# Altium schematic sheet PADS_Schemat.SchDoc
size A3; SheetNumber: 1; SheetTotal: 1
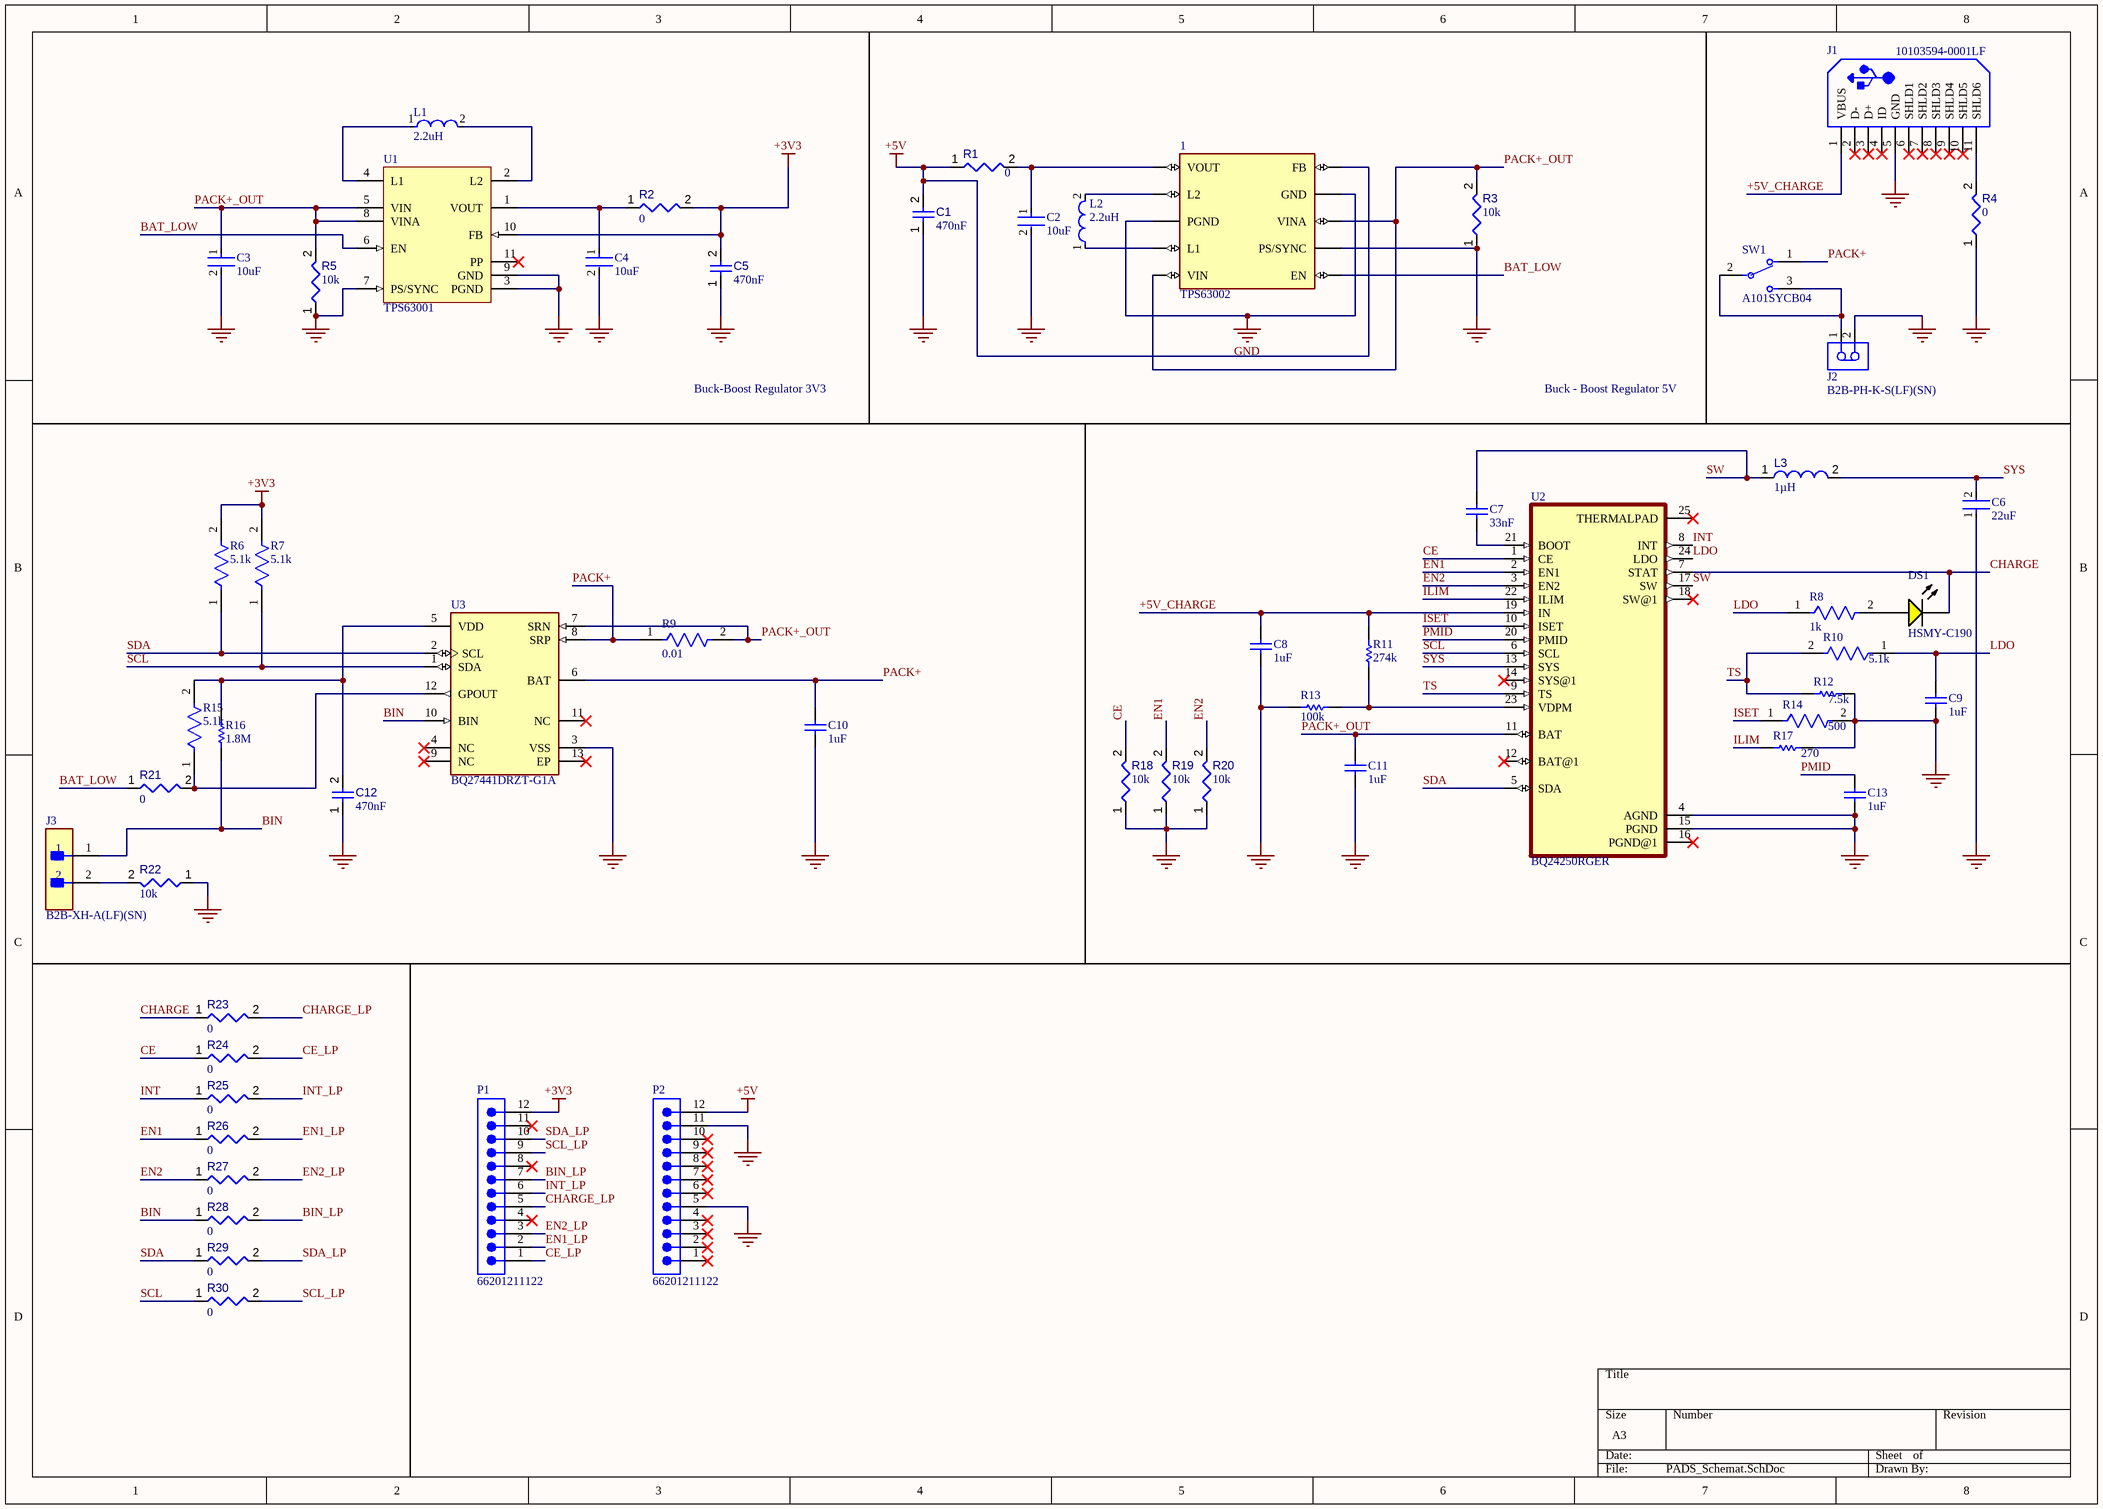
[diagram p0: PADS_Schemat.SchDoc]

## Parts
1  TPS63002  [10SON]
C1  value 470nF  [CAPC0603(1608)100_L]  (hidden comment: Capacitor 470nF +/-20% 25V 0603)
C2  10uF  [FP-GRM188-0_1-e0_2_0_55-IPC_A]
C3  10uF  [FP-GRM188-0_1-e0_2_0_55-IPC_A]
C4  10uF  [FP-GRM188-0_1-e0_2_0_55-IPC_A]
C5  value 470nF  [CAPC0603(1608)100_L]  (hidden comment: Capacitor 470nF +/-20% 25V 0603)
C6  22uF  [FP-GRM21B-0_15-MFG]
C7  33nF  [CAPC2013X95X45NL10T25]
C8  1uF  [CAPC2013X135X45LL10T25]
C9  1uF  [CAPC2013X135X45LL10T25]
C10  1uF  [CAPC2013X135X45LL10T25]
C11  1uF  [CAPC2013X135X45LL10T25]
C12  value 470nF  [CAPC0603(1608)100_L]  (hidden comment: Capacitor 470nF +/-20% 25V 0603)
C13  1uF  [CAPC2013X135X45LL10T25]
DS1  HSMY-C190  [AVAG-HSMX-C190_V]
J1  10103594-0001LF  [FCI-10103594-0001LF_V]
J2  B2B-PH-K-S(LF)(SN)  [JST-B2B-PH-K-S_V]
J3  B2B-XH-A(LF)(SN)  [FP-B2B-XH-A_LF_SN-MFG]
L1  2.2uH  [FP-LQM21PH_G0-IPC_C]
L2  2.2uH  [FP-LQM21PH_G0-IPC_C]
L3  value 1µH  [INDC2520X120X60NL20T20]  (hidden comment: LQM2HPN1R0MJ0L)
P1  66201211122  [66201211122]
P2  66201211122  [66201211122]
R1  value 0  [RESC0603(1608)_L]  (hidden comment: 0R3J)
R2  value 0  [RESC0603(1608)_L]  (hidden comment: 0R3J)
R3  value 10k  [RESC0402(1005)_L]  (hidden comment: 10KR2F)
R4  value 0  [RESC0603(1608)_L]  (hidden comment: 0R3J)
R5  value 10k  [RESC0402(1005)_L]  (hidden comment: 10KR2F)
R6  5.1k  [FP-CRCW0603-e3-IPC_C]
R7  5.1k  [FP-CRCW0603-e3-IPC_C]
R8  1k  [FP-ERA3A-IPC_C]
R9  0.01  [FP-ERJ8CW-MFG]
R10  5.1k  [FP-CRCW0603-e3-IPC_C]
R11  274k  [RESC1608X55X30NL15T15]
R12  7.5k  [RESC1609X55X30NL10T20]
R13  100k  [RESC2013X70X40NL20T20]
R14  500  [FP-MCT0603-MFG]
R15  5.1k  [FP-CRCW0603-e3-IPC_C]
R16  1.8M  [RESC1608X55X30ML15T15]
R17  270  [RESC1608X55X30LL15T15]
R18  value 10k  [RESC0402(1005)_L]  (hidden comment: 10KR2F)
R19  value 10k  [RESC0402(1005)_L]  (hidden comment: 10KR2F)
R20  value 10k  [RESC0402(1005)_L]  (hidden comment: 10KR2F)
R21  value 0  [RESC0603(1608)_L]  (hidden comment: 0R3J)
R22  value 10k  [RESC0402(1005)_L]  (hidden comment: 10KR2F)
R23  value 0  [RESC0603(1608)_L]  (hidden comment: 0R3J)
R24  value 0  [RESC0603(1608)_L]  (hidden comment: 0R3J)
R25  value 0  [RESC0603(1608)_L]  (hidden comment: 0R3J)
R26  value 0  [RESC0603(1608)_L]  (hidden comment: 0R3J)
R27  value 0  [RESC0603(1608)_L]  (hidden comment: 0R3J)
R28  value 0  [RESC0603(1608)_L]  (hidden comment: 0R3J)
R29  value 0  [RESC0603(1608)_L]  (hidden comment: 0R3J)
R30  value 0  [RESC0603(1608)_L]  (hidden comment: 0R3J)
SW1  A101SYCB04  [FP-A101SYCB04-MFG]
U1  TPS63001  [DRC0010J_V]
U2  BQ24250RGER  [QFN50P400X400X100-25N]
U3  BQ27441DRZT-G1A  [FP-DRZ0012A-MFG]

## Nets
+3V3: C5.2 P1.12 R2.2 R6.2 R7.2 U1.10(FB)
+5V: 1.P$10(FB) C1.2 P2.12 R1.1
GND: 1.P$3(PGND) 1.P$7(PS/SYNC) 1.P$9(GND) C1.1 C2.2 C3.2 C4.2 C5.1 C6.1 C8.1 C9.1 C10.1 C11.1 C12.1 C13.1 J1.5(GND) J2.2 P2.5 P2.11 R3.1 R4.1 R5.1 R12.2 R13.1 R14.2 R17.2 R18.1 R19.1 R20.1 R22.1 U1.3(PGND) U1.7(PS/SYNC) U1.9(GND) U2.4(AGND) U2.15(PGND) U3.3(VSS)
+5V_CHARGE: C8.2 J1.1(VBUS) R11.2 U2.19(IN)
BAT_LOW: 1.P$6(EN) R21.1 U1.6(EN)
BIN: J3.1 R16.1 R28.1 U3.10(BIN)
BIN_LP: P1.7 R28.2
CE: R18.2 R24.1 U2.1(CE)
CE_LP: P1.1 R24.2
CHARGE: DS1.2(K) R23.1 U2.7(STAT)
CHARGE_LP: P1.5 R23.2
EN1: R19.2 R26.1 U2.2(EN1)
EN1_LP: P1.2 R26.2
EN2: R20.2 R27.1 U2.3(EN2)
EN2_LP: P1.3 R27.2
ILIM: R17.1 U2.22(ILIM)
INT: R25.1 U2.8(INT)
INT_LP: P1.6 R25.2
ISET: R14.1 U2.10(ISET)
LDO: C9.2 R8.1 R10.1 U2.24(LDO)
PACK+: C10.2 R9.1 SW1.1 U3.6(BAT) U3.8(SRP)
PACK+_OUT: 1.P$5(VIN) 1.P$8(VINA) C3.1 C11.2 R3.2 R5.2 R9.2 U1.5(VIN) U1.8(VINA) U2.11(BAT) U3.7(SRN)
PMID: C13.2 U2.20(PMID)
SCL: R7.1 R30.1 U2.6(SCL) U3.1(SDA)
SCL_LP: P1.9 R30.2
SDA: R6.1 R29.1 U2.5(SDA) U3.2(SCL)
SDA_LP: P1.10 R29.2
SW: C7.2 L3.1 U2.17(SW)
SYS: C6.2 L3.2 U2.13(SYS)
TS: R10.2 R12.1 U2.9(TS)
Net1_P$1: 1.P$1(VOUT) C2.1 R1.2
Net1_P$2: 1.P$2(L2) L2.2
Net1_P$4: 1.P$4(L1) L2.1
NetC4_1: C4.1 R2.1 U1.1(VOUT)
NetC7_1: C7.1 U2.21(BOOT)
NetC12_2: C12.2 R15.2 R16.2 U3.5(VDD)
NetDS1_1: DS1.1(A) R8.2
NetJ1_11: J1.11(SHLD6) R4.2
NetJ2_1: J2.1 SW1.2 SW1.3
NetJ3_2: J3.2 R22.2
NetL1_1: L1.1 U1.4(L1)
NetL1_2: L1.2 U1.2(L2)
NetR11_1: R11.1 R13.2 U2.23(VDPM)
NetR15_1: R15.1 R21.2 U3.12(GPOUT)

Not connected (* = marked no-connect by the designer): J1 2(D-)* 3(D+)* 4(ID)* 6(SHLD1)* 7(SHLD2)* 8(SHLD3)* 9(SHLD4)* 10(SHLD5)*; P1 4* 8* 11*; P2 1* 2* 3* 4* 6* 7* 8* 9* 10*; U1 11(PP)*; U2 12(BAT@1)* 14(SYS@1)* 16(PGND@1)* 18(SW@1)* 25(THERMALPAD)*; U3 4(NC)* 9(NC)* 11(NC)* 13(EP)*

## Notes on the sheet
- Buck-Boost Regulator 3V3
- Buck - Boost Regulator 5V

## Library data of the parts
1 = CMP-023-000000-1: Buck-Boost Switching Regulator IC Positive Fixed 5V 1 Output 1.6A _Switch_ 10-VFDFN Exposed Pad; MF: Texas Instruments; MP: TPS63002; Value: *; SnapEDA_Link: https://www.snapeda.com/parts/TPS63002/Texas%20Instruments/view-part/509729/?ref=snap; Pin Count: 10; Package: QFN-10 Texas Instruments; Component Type: Standard; Availability: Unavailable; Design Item ID: TPS63002; Price: None; Source: SnapEDAsch.SchLib
C1 C5 C12 = CMP-001-00077-3: Chip Capacitor, 470nF +/-20%, 25V, 0603, Thickness 1 mm; Tolerance: 10%; Max Operating Temperature: 85°C; Voltage Rating: 25V; Pins: 2; Case/Package: 0603; Mounting Technology: SMT; Min Operating Temperature: -55°C
C2-C4 = CMP-2006-02792-2: Chip Multilayer Ceramic Capacitors for General Purpose, 0603, 10uF, X5R, 15%, 20%, 6.3V; Packaging: Tape and Reel; Voltage Rating (DC): 6.3V; Width: 0.031inch; Termination: SMD/SMT; Dielectric: X5R; Package Quantity: 4000; Voltage Rating: 6.3V; Capacitance: 10uF; Case/Package: 0603; Min Operating Temperature: -55°C; Voltage: 6.3V; Length: 1.6mm; Thickness: 0.035inch; Lead Free: Lead Free; Depth: 0.8mm; Case Code (Imperial): 0603; Max Operating Temperature: 85°C; Material: Ceramic; Height: 0.8mm; Tolerance: 20%; Mount: Surface Mount; REACH SVHC: No SVHC; Radiation Hardening: No; Case Code (Metric): 1608
C6 = CMP-2007-03385-2: Chip Multilayer Ceramic Capacitors for General Purpose, 0805, 22uF, X5R, 15%, 20%, 6.3V; Material: Ceramic; Max Operating Temperature: 85°C; Voltage: 6.3V; Min Operating Temperature: -55°C; Case/Package: 0805; Thickness: 0.053inch; Dielectric: X5R; Packaging: Tape and Reel; Depth: 1.25mm; Termination: SMD/SMT; Voltage Rating (DC): 6.3V; Radiation Hardening: No; Tolerance: 20%; Mount: Surface Mount; Lead Free: Lead Free; Package Quantity: 1; REACH SVHC: No SVHC; Voltage Rating: 6.3V; Capacitance: 22uF; Length: 2mm; Case Code (Imperial): 0805; Case Code (Metric): 2012; Width: 0.049inch; Height: 1.25mm
C7 = CMP-1036-04169-2: Manufacturer: Murata; Part Number: GRM219R71H333KA01D
C8-C11 C13 = CMP-2007-03460-1: Manufacturer: Murata; Part Number: GRM21BR71C105KA01K
DS1 = CMP-1744-00003-1: LED Uni-Color Yellow, 65 mW, 20 mA, -40 to 85 degC, 2-Pin SMD, RoHS, Tape and Reel; Tolerance: 1%; Voltage Rating: 50 V; Power Rating: 100 mW; Case\Package: 0603; Resistance: 390 Ohm; Min Operating Temperature: -55 degC; Length: 1.6 mm; ComponentLink3Description: Package Specification; Mount: Surface Mount; PackageReference: HSMX-C190; ComponentLink2Description: Datasheet; DatasheetVersion: Mar-12; Case Code (Metric): 1608; Pins: 2; Package Quantity: 5000; ComponentLink2URL: http://docs.avagotech.com/docs/AV02-0551EN; ComponentLink1Description: Manufacturer URL; RoHSCompliant: true; Packaging: Tape and Reel; PackageDescription: 2-Pin Surface Mount Device, Body 1.6 x 0.8 mm, Height 0.9 mm; REACH SVHC: No SVHC; ComponentLink3URL: http://www.fairchildsemi.com/dwg/MA/MA03D.pdf; Voltage Rating (DC): 50 V; Width: 0.8 mm; ComponentLink1URL: http://www.avagotech.com/; Max Operating Temperature: 155 degC; Case Code (Imperial): 0603; Height: 0.45 mm
J1 = CMP-002-00038-2: Micro USB 2.0 B Receptacle, 5 Position, Height 3.24 mm, -55 to 85 degC, RoHS, Tape and Reel; Manufacturer: FCI Electronics; Gender: Female; Current Rating: 1.8A; Voltage Rating: 100V; Min Operating Temperature: -55°C; Package Reference: FCI-10103594-0001LF; Max Operating Temperature: 85°C; Lead Pitch: 0.65mm; Case/Package: FCI-10103594-0001LF; Package Quantity: 1500; Connector Type: USB; Mounting Technology: SM; Datasheet Version: Rev. A, 06/2010; Contact Material: Copper; Package Description: 5-Pin Surface Mount Device, Body 8.04 x 5.62 mm; Contact Plating: Gold; Packaging: TapeandReel; Datasheet URL: http://portal.fciconnect.com/Comergent//fci/drawing/10103594.pdf; Pins: 5; RoHS Compliant: True; Manufacturer URL: http://portal.fciconnect.com/
J2 = CMP-2000-05162-1: Male Header, Pitch 2 mm, 1 x 2 Position, Height 6 mm, Tail Length 3.4 mm, -25 to 85 degC, RoHS, Bulk; Manufacturer: JST; Pitch: 2mm; Style/Orientation: StraightHeader/Plug; No of Positions: 2; Datasheet Version: Nov-08; Datasheet URL: http://datasheet.octopart.com/B2B-PH-K-S%28LF%29%28SN%29-JST-datasheet-8324864.pdf; Manufacturer URL: http://www.jst.com/home2.html; Type: ShroudedHeader; Termination: Crimp
J3 = CMP-2000-05888-3: CONN HEADER VERT 2POS 2.5MM; Current Rating: 3A; Voltage Rating: 250V; Number of Contacts: 2; Contact Resistance: 20mR; Wire/Cable Gauge: 22AWG; Insulation Resistance: 1GR; Connector Type: Male Pin; Packaging: Bulk; Contact Material: Brass; Lead Free: Lead Free; Orientation: Straight; Contact Plating: Tin; Max Current Rating: 3A; Termination: Solder; Fastening Type: Detent; Depth: 5.75mm; Housing Material: Polyamide; REACH SVHC: No SVHC; Series: XH; Voltage Rating (AC): 250V; Number of Positions: 2; Color: Natural; Contact Type: Male Pin; Max Voltage Rating (DC): 250V; Pitch: 2.5mm; Lead Pitch: 2.5mm; Mount: Through Hole; Max Operating Temperature: 85°C; Length: 7.4mm; Max Voltage Rating (AC): 250V; Min Operating Temperature: -25°C; Number of Rows: 1; Housing Color: White
L1 L2 = CMP-06042-016317-1: Multilayer Type Inductor for Power Lines, 0805 (2012), 2.2μH, 30%, 0.288Ω, 0.8A; Test Frequency: 1MHz; Shielding: Shielded; Current Rating: 800mA; Self Resonant Frequency: 40MHz; Core Material: Ferrite; DC Resistance (DCR): 288mR; RoHS Compliant: Yes; REACH SVHC: No SVHC; Inductance Tolerance: 30%; Package Quantity: 4000; Military Standard: Not; Max Operating Temperature: 125°C; Radiation Hardening: No; Series: LQM; Height - Seated (Max): 0.039inch; Tolerance: 30%; Height: 0.9mm; Lead Free: Lead Free; Case Code (Metric): 2012; Packaging: Tape and Reel; Termination: SMD/SMT; Case Code (Imperial): 0805; Min Operating Temperature: -55°C; Depth: 1.4mm; Mount: Surface Mount; Length: 2mm; Inductance: 2.2uH; DC Current: 800mA; Case/Package: 0805; Max DC Current: 800mA; Width: 0.049inch
L3 = CMP-006-00008-6: Chip Inductor, 1 uH, +/- 20%, 1 MHz, -55 to 125 degC, 1008 (2520 Metric), RoHS, Tape and Reel; Manufacturer: Murata; Self Resonant Frequency: 70MHz; Current Rating: 1.5A; Shielding: Shielded; Core Material: Ferrite; Resistance: 0.09Ohm; Datasheet URL: http://psearch.en.murata.com/inductor/product/LQM2HPN1R0MJ0%23.pdf; Datasheet Version: Aug-16; RoHS Compliant: True; Case/Package: 1008; Package Description: 2-Pin Surface Mount Device, Body 2.5 x 2 mm; Package Quantity: 3000; Tolerance: 20%; Min Operating Temperature: -40°C; Package Reference: 1008; Packaging: TapeandReel; Mounting Technology: SM; Max Operating Temperature: 85°C
P1 P2 = CMP-1502-00450-2: NexarPartId: 23024716; Connector Type: Male Pin, Socket; Current Rating: 5A; Number of Positions: 12; Gender: Male; Contact Resistance: 10mΩ; Operating Supply Voltage: 250V; Pitch: 3mm; Insulation Resistance: 1GΩ; Number of Rows: 1; Mount: Through Hole; REACH SVHC: Unknown; Color: Black; Min Operating Temperature: -40°C; Termination: Kinked Pin; Contact Plating: Tin; RoHS: Compliant; Max Operating Temperature: 105°C; Height: 11mm; Width: 39.65mm; Length: 39.65mm; Lead Pitch: 3mm; Number of Contacts: 12; Orientation: Vertical; Contact Material: Copper; Number of Pins: 12; Fastening Type: Ramp
R1 R2 R4 R21 R23-R30 = CMP-009-00063-2: Jumper 0603 (1608 Metric); Case/Package: 0603; Mounting Technology: SMT; Pins: 2
R3 R5 R18-R20 R22 = CMP-009-00066-2: 10K 0.063W 1% 0402 (1005 Metric)  SMD; Power: 63mW; Case/Package: 0402; Mounting Technology: SMT; Pins: 2; Tolerance: 1%
R6 R7 R10 R15 = CMP-1012-00590-3: RES Thick Film, 5.1kΩ, 1%, 0.1W, 100ppm/°C, 0603; Power Rating: 100mW; Voltage Rating (DC): 75V; Resistance: 5.1kR; Width: 0.85mm; Depth: 0.85mm; Military Standard: Not; Package Quantity: 5000; Case Code (Metric): 1608; Length: 1.55mm; Weight: 7.1E-05oz; Packaging: Tape and Reel; Temperature Coefficient: 100ppm/°C; Case Code (Imperial): 0603; Lead Free: Lead Free; Radiation Hardening: No; Contact Plating: Tin; Composition: Thick Film; Max Operating Temperature: 155°C; Termination: SMD/SMT; Case/Package: 0603; Min Operating Temperature: -55°C; Tolerance: 1%; Voltage Rating: 75V; Mount: Surface Mount; Height: 0.45mm
R8 = CMP-2000-00873-2: RES SMD 1K OHM 0.1% 1/10W 0603; Temperature Coefficient: 25ppm/°C; Voltage Rating: 75V; Max Power Dissipation: 100mW; Resistance: 1kR; Technology: METAL FILM; Number of Pins: 2; Packaging: Tape and Reel; Case Code (Imperial): 0603; Case Code (Metric): 1608; Min Operating Temperature: -55°C; REACH SVHC: No SVHC; Length: 1.6mm; Termination: SMD/SMT; Depth: 0.8mm; Resistance Tolerance: 0.1%; Number of Terminations: 2; Width: 0.8mm; Military Standard: Not; Tolerance: 0.1%; Package Quantity: 5000; Contact Plating: Tin; Height: 0.45mm; Construction: Rectangular; Case/Package: 0603; Max Operating Temperature: 155°C; Resistor Type: Thin Film; Series: ERA-3A; Size Code: 0603; RoHS Compliant: Yes; Mount: Surface Mount; Radiation Hardening: No; Power Rating: 100mW
R9 = CMP-2003-00786-2: RES 0.01 OHM 1% 1W 1206; Temperature Coefficient: 75ppm/°C; Resistance: 10mR; Military Standard: Not; Depth: 1.6mm; Mount: Surface Mount; Resistor Type: Thick Film; Termination: Flat; Features: Automotive AEC-Q200; Number of Terminations: 2; Max Power Dissipation: 1W; Tolerance: 1%; Case Code (Imperial): 1206; Max Operating Temperature: 125°C; Case Code (Metric): 3216; Lead Free: Lead Free; Case/Package: 1206; Power Rating: 1W; Width: 0.063inch; Packaging: Cut Tape; Length: 3.2mm; Height: 0.03inch; REACH SVHC: No SVHC; Min Operating Temperature: -55°C
R11 = CMP-2000-00395-1: Manufacturer: Panasonic; Part Number: ERJ-3EKF2743V
R12 = CMP-2000-03794-1: Part Number: TNPW06037K50BEEA; Manufacturer: Vishay Dale
R13 = CMP-2001-00338-1: Part Number: ERJ-6GEYJ104V; Manufacturer: Panasonic
R14 = CMP-02407-010017-1: RES SMD 100 OHM 1% 1/8W 0603; Resistance: 500R; Tolerance: 0.1%; Height: 450um; Length: 1.55mm; Width: 850um; Case/Package: 0603; Lead Free: Lead Free
R16 = CMP-2000-00297-1: Manufacturer: Panasonic; Part Number: ERJ-3EKF1804V
R17 = CMP-2000-00388-1: Manufacturer: Panasonic; Part Number: ERJ3EKF2700V
SW1 = CMP-03408-000017-1: SWITCH TOGGLE SPDT 0.4VA 20V; Electrical Life: 6000Cycles; Number of Poles: 1; Power Rating: 400mW; Switch Function: On-On; Contact Resistance: 10mR; Contact Current Rating: 400mA; Actuator Material: Phenolic; Insulation Resistance: 30MR; Actuator Color: Chrome; Number of Positions: 2; Actuator Type: Standard Round; Actuator Length: 10.41mm; Illumination Type: Non-Illuminated; Flammability Rating: UL94 V-1; Contact Material: Copper; Depth: 6.86mm; Contact Plating: Gold; Voltage Rating (AC): 20V; Max Voltage Rating (DC): 20V; Min Operating Temperature: -30°C; Max Operating Temperature: 85°C; Throw Configuration: SPDT; Packaging: Bulk; Termination: PC Pins; Series: Gemini A; ELV: Compliant; Lead Free: Lead Free; RoHS Compliant: Yes; REACH SVHC: No SVHC; Mount: Panel; Orientation: Straight; Package Quantity: 100; Max Voltage Rating (AC): 20V; Radiation Hardening: No; Voltage Rating (DC): 20V
U1 = CMP-0345-00006-2: Buck-Boost Voltage Converter with 1.8 to 5.5 V Input and 3.3 V Output, -40 to 85 degC, 10-Pin SON (DRC), Green (RoHS & no Sb/Br); PartNumber: TPS63001DRCR; Manufacturer: Texas Instruments; Synchronous Rectification: TRUE; Iq(Typ)(mA): 0.03; Regulated Outputs(#): 1; Preset Vout(V): 3.3; Vin(Min)(V): 1.8; Switching Frequency(Max)(kHz): 1500; Iout(Max)(A): 1.2; SubFamily: Buck-Boost Regulator; Vin(Max)(V): 5.5; Topology: Buck-Boost; Dynamic Voltage Scaling: TRUE; PackageVersion: revL, Sep-2011; ComponentLink2Description: Package Specification; DatasheetVersion: SLVS520B; Eco-Plan: Green (RoHS & no Sb/Br); ComponentLink1URL: http://www.ti.com/general/docs/lit/getliterature.tsp?genericPartNumber=TPS63001&fileType=pdf; Mounting Technology: Surface Mount; Vout(Min)(V): 3.3; ComponentLink2URL: http://www.ti.com/litv/pdf/mpds117k; PackageDescription: 10-Pin Plastic Small Outline No-Lead, 3 x 3 x 1 mm Body, 0.5 mm Pitch, Exposed Pad; PackageReference: DRC0010J; Vout(Max)(V): 3.3; ComponentLink1Description: Datasheet
U2 = BQ24250RGER: 1-cell, 2-A, I2C controlled buck battery charger with 1uA in SYSOFF mode and TS disable function 24-VQFN; MF: Texas Instruments; Value: *; Purchase-URL: https://pricing.snapeda.com/search/part/BQ24250RGER/?ref=eda; MP: BQ24250RGER; Package: VQFN-24 Texas Instruments; Check_prices: https://www.snapeda.com/parts/BQ24250RGER/Texas%20Instruments/view-part/85379/?ref=eda; Price: None; SnapEDA_Link: https://www.snapeda.com/parts/BQ24250RGER/Texas%20Instruments/view-part/85379/?ref=snap; Availability: Unavailable
U3 = CMP-04911-000005-1: IC BATT FUEL GAUGE LICOO2 12SON; Manufacturer: Texas Instruments; Nominal Supply Current: 93uA; Standoff Height: 0mm; Output Voltage: 1.8V; Number Of Outputs: 1; Min Supply Voltage: 2.45V; Max Supply Voltage: 4.5V; ComponentLink2URL: http://www.ti.com/lit/ds/symlink/bq27441-g1.pdf; Device Class L1: Integrated Circuits (ICs); Package: DRZ0012A; Number Of Cells: 1; Mouser Description: Battery Management System-Side Impdance Trck Bttry Fuel Gge; ComponentLink2Description: Datasheet; Device Class L2: Power Management ICs; Temperature Range High: +85°C; Category: IC; Automotive: No; Octopart: https://octopart.com/bq27441drzt-g1a-texas+instruments-30555831; Temperature Range Low: -40°C; Device Class L3: Battery Management; RoHS: TRUE; Height: 1mm; Digikey Description: IC BATT FUEL GAUGE LICOO2 12SON; Temperature: -40°C to +85°C; Ambient Temperature Range High: +85°C; Ambient Temperature Range Low: -40°C; Manufacturer Part Number: BQ27441DRZT-G1A; Lead Free: Yes